# Altium schematic sheet PCB.SchDoc
size Letter; SheetNumber: 1; SheetTotal: 1
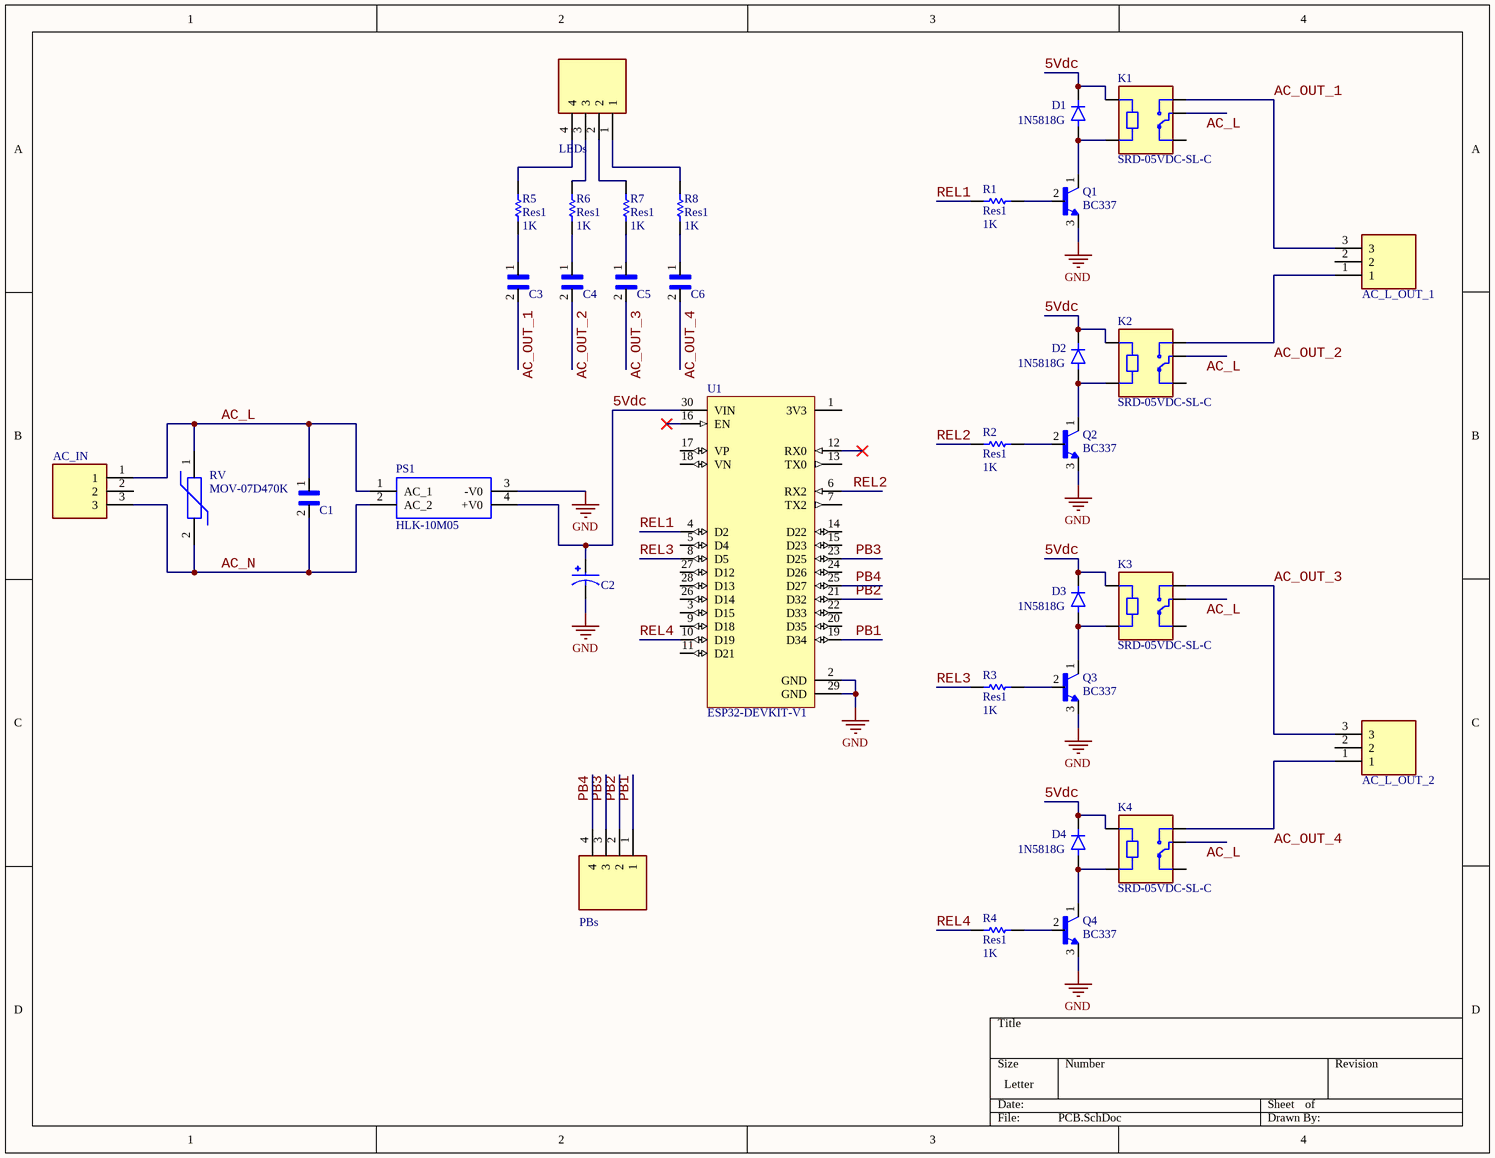
[diagram p0: PCB.SchDoc]

## Parts
AC_IN  TB006-508-03BE  [CUI_TB006-508-03BE]  (value not drawn)
AC_L_OUT_1  TB006-508-03BE  [CUI_TB006-508-03BE]  (value not drawn)
AC_L_OUT_2  TB006-508-03BE  [CUI_TB006-508-03BE]  (value not drawn)
C1  ECQE4123KFW  [CAPRR750W60L1030T440H1250]  (value not drawn)
C2  25YXG220MEFC6.3X11  [CAPPRD250W50D630H1250]  (value not drawn)
C3  ECQE4123KFW  [CAPRR750W60L1030T440H1250]  (value not drawn)
C4  ECQE4123KFW  [CAPRR750W60L1030T440H1250]  (value not drawn)
C5  ECQE4123KFW  [CAPRR750W60L1030T440H1250]  (value not drawn)
C6  ECQE4123KFW  [CAPRR750W60L1030T440H1250]  (value not drawn)
D1  1N5818G  [DIOAD1036W78L470D235]
D2  1N5818G  [DIOAD1036W78L470D235]
D3  1N5818G  [DIOAD1036W78L470D235]
D4  1N5818G  [DIOAD1036W78L470D235]
K1  SRD-05VDC-SL-C  [RELAY_SRD-05VDC-SL-C]
K2  SRD-05VDC-SL-C  [RELAY_SRD-05VDC-SL-C]
K3  SRD-05VDC-SL-C  [RELAY_SRD-05VDC-SL-C]
K4  SRD-05VDC-SL-C  [RELAY_SRD-05VDC-SL-C]
LEDs  TB007-508-04BE  [CUI_TB007-508-04BE]  (value not drawn)
PBs  TB007-508-04BE  [CUI_TB007-508-04BE]  (value not drawn)
PS1  HLK-10M05  [HLK10M05]
Q1  BC337  [TO92250P510H770-3]
Q2  BC337  [TO92250P510H770-3]
Q3  BC337  [TO92250P510H770-3]
Q4  BC337  [TO92250P510H770-3]
R1  Res1  value 1K  [AXIAL-0.3]
R2  Res1  value 1K  [AXIAL-0.3]
R3  Res1  value 1K  [AXIAL-0.3]
R4  Res1  value 1K  [AXIAL-0.3]
R5  Res1  value 1K  [AXIAL-0.3]
R6  Res1  value 1K  [AXIAL-0.3]
R7  Res1  value 1K  [AXIAL-0.3]
R8  Res1  value 1K  [AXIAL-0.3]
RV  MOV-07D470K  [MOV-07DXXXK(3.9T)]
U1  ESP32-DEVKIT-V1  [ESP32-DEVKIT-V1]

## Nets
GND: C2.N PS1.3(-V0) Q1.3(E) Q2.3(E) Q3.3(E) Q4.3(E) U1.2(GND) U1.29(GND)
5Vdc: C2.P D1.C(K) D2.C(K) D3.C(K) D4.C(K) K1.A1 K2.A1 K3.A1 K4.A1 PS1.4(+V0) U1.30(VIN)
AC_L: AC_IN.1 C1.1 K1.COM K2.COM K3.COM K4.COM PS1.1(AC_1) RV.1
AC_N: AC_IN.3 C1.2 PS1.2(AC_2) RV.2
AC_OUT_1: AC_L_OUT_1.3 C3.2 K1.NO
AC_OUT_2: AC_L_OUT_1.1 C4.2 K2.NO
AC_OUT_3: AC_L_OUT_2.3 C5.2 K3.NO
AC_OUT_4: AC_L_OUT_2.1 C6.2 K4.NO
PB1: PBs.1 U1.19(D34)
PB2: PBs.2 U1.21(D32)
PB3: PBs.3 U1.23(D25)
PB4: PBs.4 U1.25(D27)
REL1: R1.1 U1.4(D2)
REL2: R2.1 U1.6(RX2)
REL3: R3.1 U1.8(D5)
REL4: R4.1 U1.10(D19)
NetC3_1: C3.1 R5.1
NetC4_1: C4.1 R6.1
NetC5_1: C5.1 R7.1
NetC6_1: C6.1 R8.1
NetD1_A: D1.A K1.A2 Q1.1(C)
NetD2_A: D2.A K2.A2 Q2.1(C)
NetD3_A: D3.A K3.A2 Q3.1(C)
NetD4_A: D4.A K4.A2 Q4.1(C)
NetLEDs_1: LEDs.1 R8.2
NetLEDs_2: LEDs.2 R7.2
NetLEDs_3: LEDs.3 R6.2
NetLEDs_4: LEDs.4 R5.2
NetQ1_2: Q1.2(B) R1.2
NetQ2_2: Q2.2(B) R2.2
NetQ3_2: Q3.2(B) R3.2
NetQ4_2: Q4.2(B) R4.2

Not connected (* = marked no-connect by the designer): AC_IN 2; AC_L_OUT_1 2; AC_L_OUT_2 2; K1 NC; K2 NC; K3 NC; K4 NC; U1 1(3V3) 3(D15) 5(D4) 7(TX2) 9(D18) 11(D21) 12(RX0)* 13(TX0) 14(D22) 15(D23) 16(EN)* 17(VP) 18(VN) 20(D35) 22(D33) 24(D26) 26(D14) 27(D12) 28(D13)

## Library data of the parts
AC_IN AC_L_OUT_1 AC_L_OUT_2 = TB006-508-03BE: 2~24 Poles, Screw Type, Horizontal, 5.08 Pitch, 26~14 (AWG), Terminal Block Connector; MF: CUI Devices; Price: None; CUI_purchase_URL: https://www.cuidevices.com/product/interconnect/connectors/terminal-blocks/tb006-508-series?utm_source=snapeda.com&utm_medium=referral&utm_campaign=snapedaBOM; Purchase-URL: https://pricing.snapeda.com/search/part/TB006-508-03BE/?ref=eda; MP: TB006-508-03BE; Value: *; Package: None; SnapEDA_Link: https://www.snapeda.com/parts/TB006-508-03BE/CUI+Devices/view-part/?ref=snap; Availability: In Stock; Check_prices: https://www.snapeda.com/parts/TB006-508-03BE/CUI+Devices/view-part/?ref=eda
C2 = 25YXG220MEFC6.3X11: MF: Rubycon; Check_prices: https://www.snapeda.com/parts/25YXG220MEFC6.3X11/Rubycon/view-part/?ref=eda; Price: None; Availability: In Stock; SnapEDA_Link: https://www.snapeda.com/parts/25YXG220MEFC6.3X11/Rubycon/view-part/?ref=snap; Package: None; MP: 25YXG220MEFC6.3X11; Value: *
D1-D4 = 1N5818G: Diode Schottky 30 V 1A Through Hole Axial; MF: ON Semiconductor; Value: *; Check_prices: https://www.snapeda.com/parts/1N5818G/Onsemi/view-part/?ref=eda; Price: None; Purchase-URL: https://pricing.snapeda.com/search/part/1N5818G/?ref=eda; MP: 1N5818G; SnapEDA_Link: https://www.snapeda.com/parts/1N5818G/Onsemi/view-part/?ref=snap; Package: DO-41-2 ON Semiconductor; Availability: In Stock
K1-K4 = SRD-05VDC-SL-C: 5V Trigger Relay Module For Arduino And Raspberry Pi 5V Trigger Relay Module For Arduino And Raspberry Pi; MF: Songle Relay; Price: None; Availability: Not in stock; MP: SRD-05VDC-SL-C; Package: NON STANDARD-5 Songle Relay; SnapEDA_Link: https://www.snapeda.com/parts/SRD-05VDC-SL-C/Songle+Relay/view-part/?ref=snap; Check_prices: https://www.snapeda.com/parts/SRD-05VDC-SL-C/Songle+Relay/view-part/?ref=eda; Value: *
LEDs PBs = TB007-508-04BE: 2~24 Poles, Screw Type, Horizontal, 5.08 Pitch, 24~12 (AWG), Terminal Block Connector; MF: CUI Devices; CUI_purchase_URL: https://www.cuidevices.com/product/interconnect/connectors/terminal-blocks/tb007-508-series?utm_source=snapeda.com&utm_medium=referral&utm_campaign=snapedaBOM; Check_prices: https://www.snapeda.com/parts/TB007-508-04BE/CUI+Devices/view-part/?ref=eda; Value: *; SnapEDA_Link: https://www.snapeda.com/parts/TB007-508-04BE/CUI+Devices/view-part/?ref=snap; Price: None; Availability: In Stock; Package: None; MP: TB007-508-04BE; Purchase-URL: https://pricing.snapeda.com/search/part/TB007-508-04BE/?ref=eda
PS1 = HLK-10M05: 10W Ultra-Compact Power Module; MF: Hi-link; Package: Package; SnapEDA_Link: https://www.snapeda.com/parts/HLK-10M05/Hi-link/view-part/?ref=snap; Value: *; MP: HLK-10M05; Availability: Not in stock; Price: None; Check_prices: https://www.snapeda.com/parts/HLK-10M05/Hi-link/view-part/?ref=eda
Q1-Q4 = BC337-16_A1: TO-92, 50V, 0.8A, NPN Bipolar Transistor; MF: Taiwan Semiconductor; MP: BC337-16 A1; Availability: In Stock; Value: *; Price: None; Check_prices: https://www.snapeda.com/parts/BC337-16%20A1/Taiwan+Semiconductor/view-part/?ref=eda; SnapEDA_Link: https://www.snapeda.com/parts/BC337-16%20A1/Taiwan+Semiconductor/view-part/?ref=snap; Purchase-URL: https://pricing.snapeda.com/search/part/BC337-16 A1/?ref=eda; Package: TO-92 Taiwan Semiconductor
R1-R8 = Res1: Resistor; Published: 8-Jun-2000; LatestRevisionDate: 17-Jul-2002; LatestRevisionNote: Re-released for DXP Platform.; PackageReference: AXIAL-0.3; Publisher: Altium Limited; PackageDescription: Axial Device, Thru-Hole; 2 Leads; 0.3 in Pin Spacing
RV = MOV-07D470K: 47V 250A Varistor 1 Circuit Through Hole Disc 7mm; MF: Bourns; Package: Disc-7 Bourns; DigiKey-Purchase-URL: https://snapeda.com/shop?store=DigiKey&id=1301146; Availability: Unavailable; Value: *; MP: MOV-07D470K; Price: None; SnapEDA_Link: https://www.snapeda.com/parts/MOV-07D470K/Bourns/view-part/1301146/?ref=snap
U1 = ESP32-DEVKIT-V1: Dual core, Wi-Fi: 2.4 GHz up to 150 Mbits/s,BLE (Bluetooth Low Energy) and legacy Bluetooth, 32 bits, Up to 240 MHz
C1 C3-C6 = ECQE4123KFW: Price: None; Value: *; Package: None; Availability: Unavailable; MP: ECQE4123KFW